# Altium schematic sheet DisplaySystem_v1.SchDoc
size A
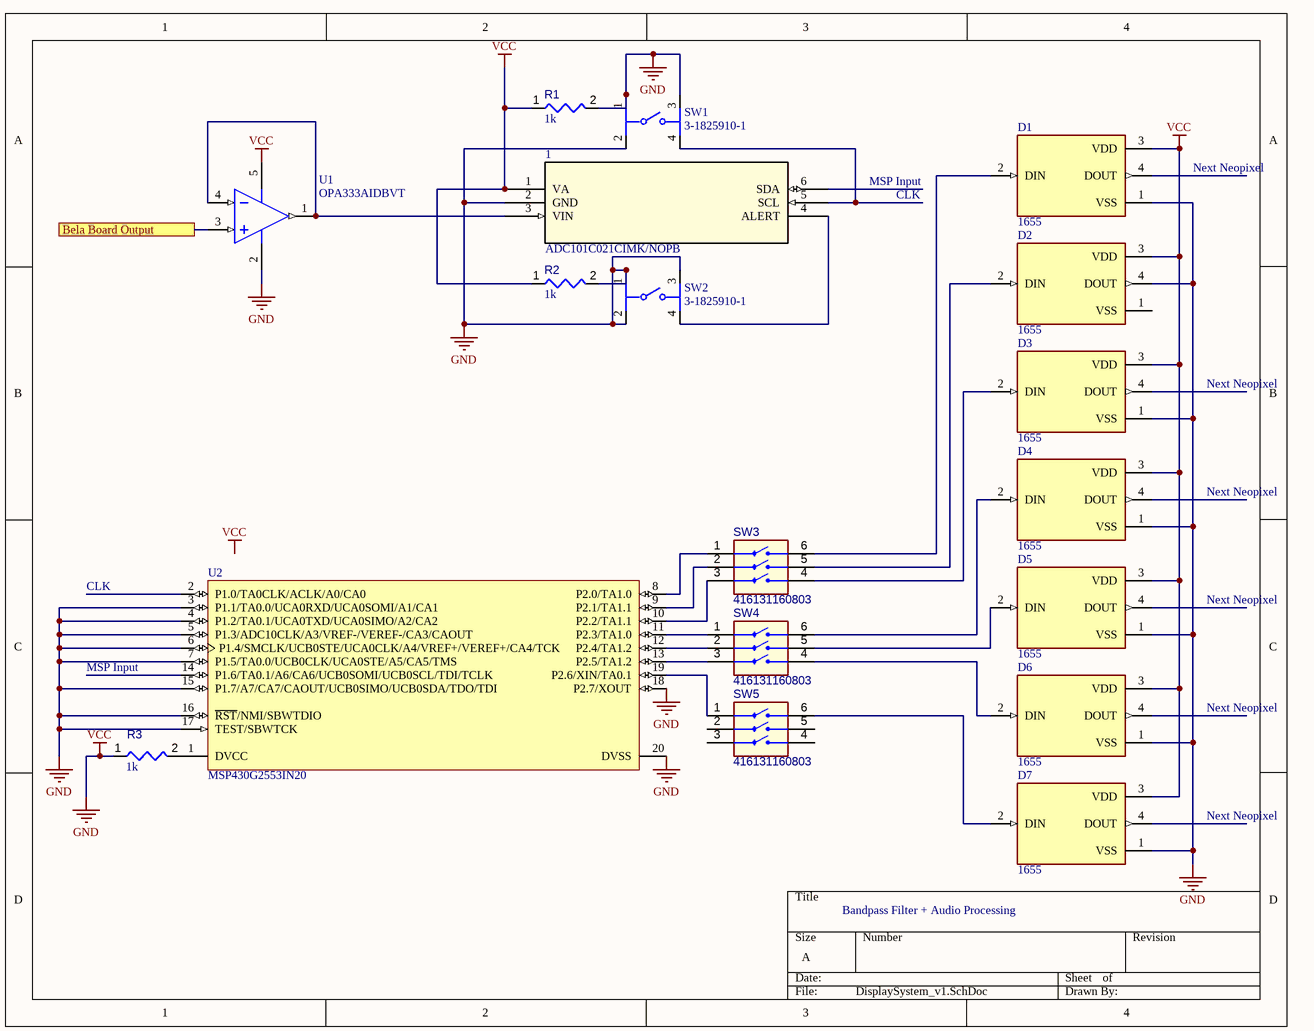
[diagram p0: DisplaySystem_v1.SchDoc]

## Parts
1  ADC101C021CIMK/NOPB  [MK06A]
D1  1655  [LED_1655]
D2  1655  [LED_1655]
D3  1655  [LED_1655]
D4  1655  [LED_1655]
D5  1655  [LED_1655]
D6  1655  [LED_1655]
D7  1655  [LED_1655]
R1  value 1k  [RESC0402(1005)_L]  (hidden comment: Resistor 2R2  +/-5 % 0402 63 mW)
R2  value 1k  [RESC0402(1005)_L]  (hidden comment: Resistor 2R2  +/-5 % 0402 63 mW)
R3  value 1k  [RESC0402(1005)_L]  (hidden comment: Resistor 2R2  +/-5 % 0402 63 mW)
SW1  3-1825910-1  [FP-3-1825910-1-MFG]
SW2  3-1825910-1  [FP-3-1825910-1-MFG]
SW3  416131160803  [416131160803]
SW4  416131160803  [416131160803]
SW5  416131160803  [416131160803]
U1  OPA333AIDBVT  [DBV0005A_M]
U2  MSP430G2553IN20  [N0020A]

## Ports
Bela Board Output

## Nets
GND: 1.1(VA) 1.2(GND) D1.1(VSS) D1.3(VDD) D2.3(VDD) D2.4(DOUT) D3.1(VSS) D3.3(VDD) D4.1(VSS) D4.3(VDD) D5.1(VSS) D5.3(VDD) D6.1(VSS) D6.3(VDD) D7.1(VSS) D7.3(VDD) R1.1 R1.2 R2.1 R2.2 R3.1 SW1.1 SW1.2 SW1.3 SW2.1 SW2.2 SW2.3 U1.2(V-) U1.5(V+) U2.3(P1.1/TA0.0/UCA0RXD/UCA0SOMI/A1/CA1) U2.4(P1.2/TA0.1/UCA0TXD/UCA0SIMO/A2/CA2) U2.5(P1.3/ADC10CLK/A3/VREF-/VEREF-/CA3/CAOUT) U2.6(P1.4/SMCLK/UCB0STE/UCA0CLK/A4/VREF+/VEREF+/CA4/TCK) U2.7(P1.5/TA0.0/UCB0CLK/UCA0STE/A5/CA5/TMS) U2.15(P1.7/A7/CA7/CAOUT/UCB0SIMO/UCB0SDA/TDO/TDI) U2.16(~{RST}/NMI/SBWTDIO) U2.17(TEST/SBWTCK) U2.18(P2.7/XOUT) U2.20(DVSS)  [also labelled VCC]
Bela Board Output: U1.3(+IN) ; port Bela Board Output
Net1_3: 1.3(VIN) U1.1(OUT) U1.4(-IN)
Net1_4: 1.4(ALERT) SW2.4
Net1_5: 1.5(SCL) SW1.4
NetD1_2: D1.2(DIN) SW3.6
NetD2_2: D2.2(DIN) SW3.5
NetD3_2: D3.2(DIN) SW3.4
NetD4_2: D4.2(DIN) SW4.6
NetD5_2: D5.2(DIN) SW4.5
NetD6_2: D6.2(DIN) SW4.4
NetD7_2: D7.2(DIN) SW5.6
NetR3_2: R3.2 U2.1(DVCC)
NetSW3_1: SW3.1 U2.8(P2.0/TA1.0)
NetSW3_2: SW3.2 U2.9(P2.1/TA1.1)
NetSW3_3: SW3.3 U2.10(P2.2/TA1.1)
NetSW4_1: SW4.1 U2.11(P2.3/TA1.0)
NetSW4_2: SW4.2 U2.12(P2.4/TA1.2)
NetSW4_3: SW4.3 U2.13(P2.5/TA1.2)
NetSW5_1: SW5.1 U2.19(P2.6/XIN/TA0.1)

Not connected (* = marked no-connect by the designer): 1 6(SDA); D1 4(DOUT); D2 1(VSS); D3 4(DOUT); D4 4(DOUT); D5 4(DOUT); D6 4(DOUT); D7 4(DOUT); SW5 2 3 4 5; U2 2(P1.0/TA0CLK/ACLK/A0/CA0) 14(P1.6/TA0.1/A6/CA6/UCB0SOMI/UCB0SCL/TDI/TCLK)

## Notes on the sheet
- Next Neopixel
- MSP Input
- CLK
- Bandpass Filter + Audio Processing
- Labels drawn without touching a wire or pin: VCC

## Library data of the parts
1 = ADC101C021CIMK/NOPB: No Description Available; Mfr_Name: Texas Instruments; Copyright: Copyright (C) 2022 Ultra Librarian. All rights reserved.; Manufacturer_Part_Number: ADC101C021CIMK/NOPB; RefDes: RefDes; Type: DEV
D1-D7 = 1655: Addressable Lighting Neopixel 10 LED Discrete Serial _Shift Register_ Red, Green, Blue _RGB_ 5.00mm L x 5.00mm W; MF: Adafruit Industries; Value: *; SnapEDA_Link: https://www.snapeda.com/parts/1655/Adafruit%20Industries%20LLC/view-part/53433/?ref=snap; Price: None; Availability: Unavailable; Package: TSOP-38238 Adafruit Industries; MP: 1655
R1-R3 = CMP-009-00128-2: Chip Resistor, 2,2 Ohms, +/-5 %, 63 mW, -55 to 155 degC, 0402; Power: 63mW; Tolerance: 5%; Case/Package: 0402; Min Operating Temperature: -55°C; Pins: 2; Max Operating Temperature: 155°C
SW1 SW2 = CMP-03407-000001-1: SWITCH TACTILE SPST-NO 0.05A 24V; Manufacturer: TE Connectivity; Operating Force: 160gf; Contact Current Rating: 50mA; Description: Switch Tactile OFF (ON) SPST Round Button PC Pins 0.05A 24VDC 100000Cycles 1.57N Thru-Hole; Contact Resistance: 100mΩ; Electromechanical Life: 100000Cycles; Device Class L1: Electromechanical; ComponentLink2URL: https://www.te.com/commerce/DocumentDelivery/DDEController?Action=srchrtrv&DocNm=1825910&DocType=Customer+Drawing&DocLang=English; Category: Switch; Device Class L2: Switches; Temperature: -35°C to +85°C; RoHS: TRUE; Mount: Through Hole; Manufacturer Part Number: 3-1825910-1; Automotive: No; Lead Free: Yes; Device Class L3: Tactile Switches; ComponentLink2Description: Datasheet; Temperature Range High: +85°C; Height: 17.3mm; Package: 0; Temperature Range Low: -35°C; Throw Configuration: SPST-NO; Digikey Description: SWITCH TACTILE SPST-NO 0.05A 24V; Octopart: https://octopart.com/3-1825910-1-te+connectivity-46506874
SW3-SW5 = CMP-011-00012-1: WS-DISV 1.27 mm small compact SMD Dip Switch with top tape; ComponentLink2URL: http://katalog.we-online.de/em/datasheet/4161311608xx.pdf; ComponentLink1URL: http://www.we-online.com; ComponentLink1Description: Manufacturer URL; Pins: 6; ComponentLink2Description: Datasheet
U1 = CMP-014-00019-1: MicroPower, Zero Drift CMOS Operational Amplifier, 1.8 to 5.5 V, 17 uA, -40 to 125 degC, 5-Pin SOT23 (DBV5), Green (RoHS & no Sb/Br), Tape and Reel; Manufacturer: Texas Instruments (TI); Nominal Supply Current: 25uA; Min Dual Supply Voltage: 900mV; Output Current: 5mA; Max Supply Voltage: 2.75V; Min Supply Voltage: 9dV; Nominal Voltage Gain: 130dB; Common Mode Rejection Ratio: 106dB; Unity Gain Bandwidth Product: 350KHz; Max I/O Voltage: 10uV; Slew Rate: 0.16V/us; Channels: 1; Manufacturer URL: http://www.ti.com/; Package Quantity: 250; Package URL: http://www.ti.com/lit/ml/mpds018l/mpds018l.pdf; Datasheet Version: SBOS351E, 12/2015; Package Reference: DBV0005A; Case/Package: SOT-23-5; Nominal Gain Bandwith Product: 350KHz; Package Description: 5-Pin Small Outline Transistor, Body 2.9 x 1.6 mm, Pitch 0.95 mm; Max Dual Supply Voltage: 2.75V; Min Operating Temperature: -40°C; Pins: 5; Packaging: TapeandReel; Datasheet URL: http://www.ti.com/general/docs/lit/getliterature.tsp?genericPartNumber=OPA333&fileType=pdf; Mounting Technology: SM; RoHS Compliant: True; Max Operating Temperature: 125°C
U2 = CMP-0365-00184-2: 16 MHz Mixed Signal Microcontroller with 16 KB Flash, 512 B SRAM and 24 GPIOs, -40 to 85 degC, 20-pin DIP (N), Pb-Free (RoHS); Manufacturer: Texas Instruments; USCI_B (I2C & SPI): 1; Temp Sensor: Yes; SubFamily: Value Line; Frequency(MHz): 16; ADC Channels: 8; SRAM(B): 512; ADC: 10-bit SAR; GPIO: 24; Timers - 16-bit: 2; Code_JEDEC: MS-001; Eco-Plan: Pb-Free (RoHS); PartNumber: MSP430G2553IN20; ComponentLink1URL: http://www.ti.com/; PackageVersion: 4040049/E; Comparators: Yes; Watchdog: Yes; ComponentLink2Description: Datasheet; ComponentLink1Description: Manufacturer URL; Mounting Technology: Through Hole; ComponentLink2URL: http://www.ti.com/general/docs/lit/getliterature.tsp?genericPartNumber=MSP430G2553&fileType=pdf; Brown Out Reset: Yes; PackageReference: N0020A; PackageDescription: 20-Pin Plastic In-Line, Body 25.40 x 6.35 mm, Pitch 2.54 mm; ComponentLink3URL: http://www.ti.com/litv/pdf/mpds177g; ComponentLink3Description: Package Specification; Flash(KB): 16; Cap touch I/O: Yes; USCI_A (UART/LIN/IrDA/SPI): 1; DatasheetVersion: SLAS735G; Manufacturer 1: Texas Instruments; Manufacturer Part Number 1: MSP430G2553IN20